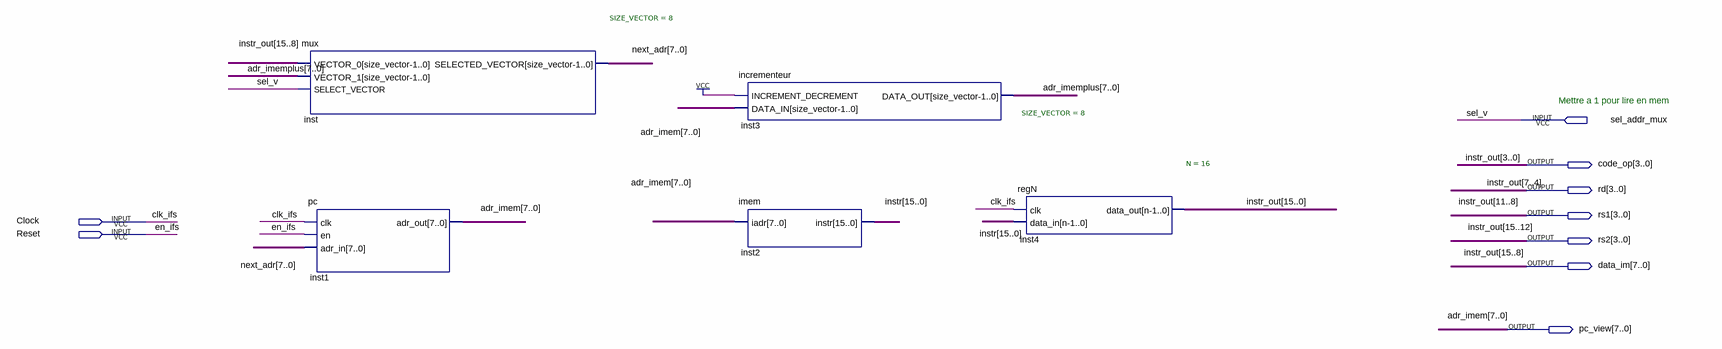
[diagram p0: schematic sheet]
// Quartus schematic IFStage.bdf as structural Verilog: 5 symbols, 9 pins
module IFStage (
  input  sel_addr_mux,
  input  Clock,
  input  Reset,
  output [3:0] code_op,
  output [3:0] rd,
  output [3:0] rs1,
  output [3:0] rs2,
  output [7:0] data_im,
  output [7:0] pc_view
);

  wire [7:0] adr_imemplus, next_adr;
  wire [15:0] instr;

  mux #(.SIZE_VECTOR(8)) inst (
    .VECTOR_0(data_im), .VECTOR_1(adr_imemplus), .SELECT_VECTOR(sel_addr_mux), .SELECTED_VECTOR(next_adr));
  pc inst1 (.clk(Clock), .en(Reset), .adr_in(next_adr), .adr_out(pc_view));
  incrementeur #(.SIZE_VECTOR(8)) inst3 (.INCREMENT_DECREMENT(1'b1), .DATA_IN(pc_view), .DATA_OUT(adr_imemplus));
  imem inst2 (.iadr(pc_view), .instr(instr));
  regN #(.N(16)) inst4 (.clk(Clock), .data_in(instr), .data_out({data_im, rd, code_op}));

  assign rs1 = data_im[3:0];
  assign rs2 = data_im[7:4];

  // Other names for the same wires on the sheet: adr_imem[7:0] = pc_view; clk_ifs = Clock; en_ifs = Reset;
  //   instr_out[15:0] = {data_im, rd, code_op}; sel_v = sel_addr_mux

  // Notes on the sheet:
  //   Mettre a 1 pour lire en mem
endmodule
